# Altium schematic sheet 0037_PCH_PCIe_SATA.SchDoc
size A3
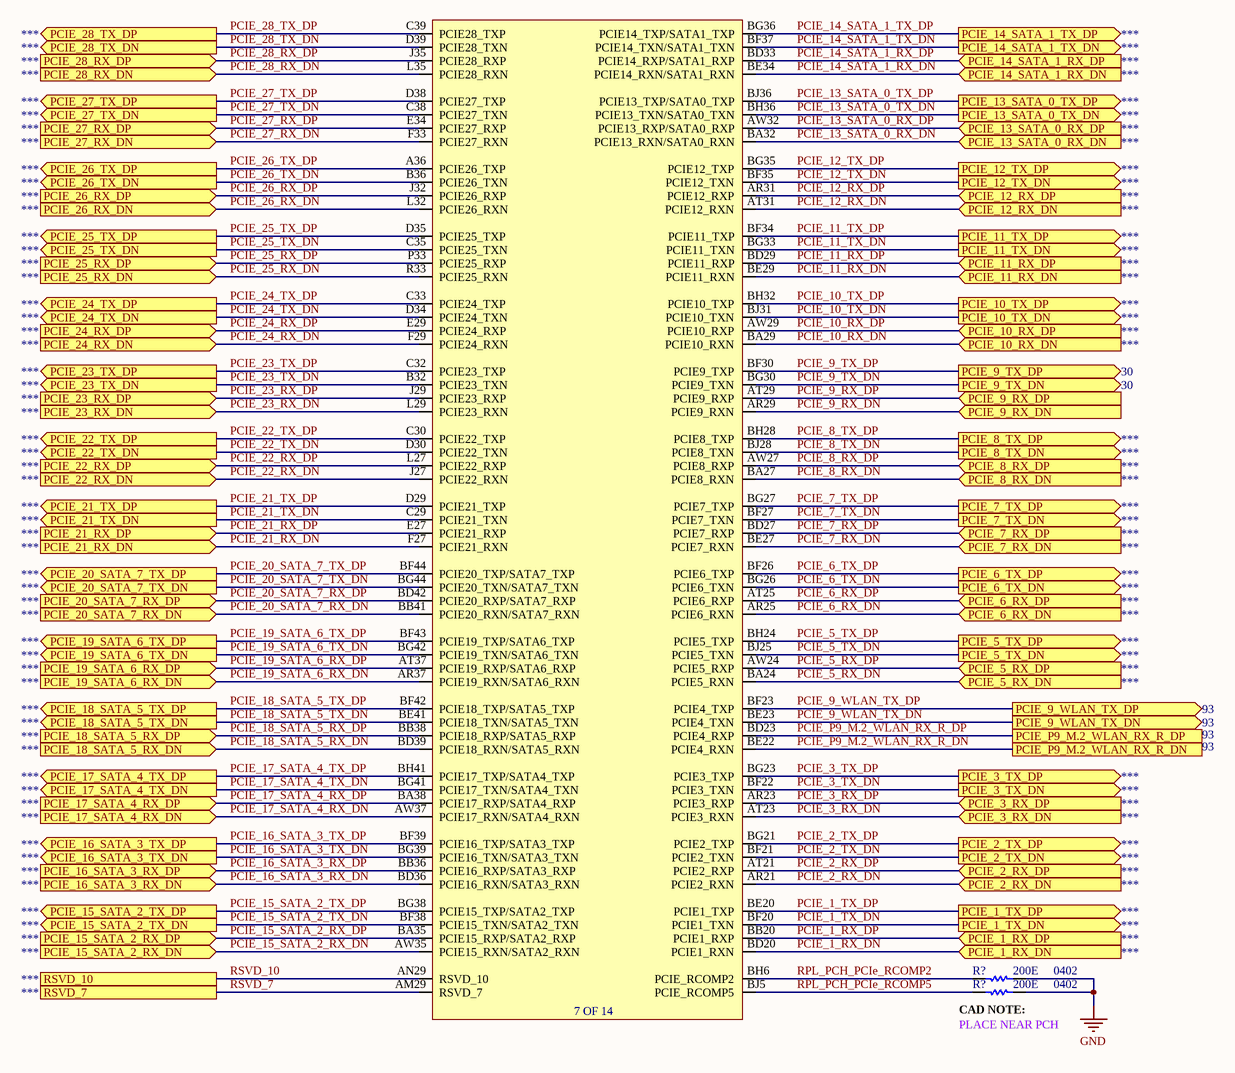
[diagram p0: 0037_PCH_PCIe_SATA.SchDoc]

## Parts
(Parts that share a designator on the sheet are numbered #1, #2 ... from top to bottom, then left to right.)
R?#1  value 200E  Case/Package: 0402  [RESC0402]  (hidden comment: Res)
R?#2  value 200E  Case/Package: 0402  [RESC0402]  (hidden comment: Res)
U23601  C_RPL_S_PCH_EXT  (value not drawn)  (part G of 14)

## Ports
PCIE_1_RX_DN (in), PCIE_1_RX_DP (in), PCIE_1_TX_DN (out), PCIE_1_TX_DP (out), PCIE_2_RX_DN (in), PCIE_2_RX_DP (in), PCIE_2_TX_DN (out), PCIE_2_TX_DP (out), PCIE_3_RX_DN (in), PCIE_3_RX_DP (in), PCIE_3_TX_DN (out), PCIE_3_TX_DP (out), PCIE_5_RX_DN (in), PCIE_5_RX_DP (in), PCIE_5_TX_DN (out), PCIE_5_TX_DP (out), PCIE_6_RX_DN (in), PCIE_6_RX_DP (in), PCIE_6_TX_DN (out), PCIE_6_TX_DP (out), PCIE_7_RX_DN (in), PCIE_7_RX_DP (in), PCIE_7_TX_DN (out), PCIE_7_TX_DP (out), PCIE_8_RX_DN (in), PCIE_8_RX_DP (in), PCIE_8_TX_DN (out), PCIE_8_TX_DP (out), PCIE_9_RX_DN (in), PCIE_9_RX_DP (in), PCIE_9_TX_DN (out), PCIE_9_TX_DP (out), PCIE_9_WLAN_TX_DN (out), PCIE_9_WLAN_TX_DP (out), PCIE_10_RX_DN (in), PCIE_10_RX_DP (in), PCIE_10_TX_DN (out), PCIE_10_TX_DP (out), PCIE_11_RX_DN (in), PCIE_11_RX_DP (in), PCIE_11_TX_DN (out), PCIE_11_TX_DP (out), PCIE_12_RX_DN (in), PCIE_12_RX_DP (in), PCIE_12_TX_DN (out), PCIE_12_TX_DP (out), PCIE_13_SATA_0_RX_DN (in), PCIE_13_SATA_0_RX_DP (in), PCIE_13_SATA_0_TX_DN (out), PCIE_13_SATA_0_TX_DP (out), PCIE_14_SATA_1_RX_DN (in), PCIE_14_SATA_1_RX_DP (in), PCIE_14_SATA_1_TX_DN (out), PCIE_14_SATA_1_TX_DP (out), PCIE_15_SATA_2_RX_DN (in), PCIE_15_SATA_2_RX_DP (in), PCIE_15_SATA_2_TX_DN (out), PCIE_15_SATA_2_TX_DP (out), PCIE_16_SATA_3_RX_DN (in), PCIE_16_SATA_3_RX_DP (in), PCIE_16_SATA_3_TX_DN (out), PCIE_16_SATA_3_TX_DP (out), PCIE_17_SATA_4_RX_DN (in), PCIE_17_SATA_4_RX_DP (in), PCIE_17_SATA_4_TX_DN (out), PCIE_17_SATA_4_TX_DP (out), PCIE_18_SATA_5_RX_DN (in), PCIE_18_SATA_5_RX_DP (in), PCIE_18_SATA_5_TX_DN (out), PCIE_18_SATA_5_TX_DP (out), PCIE_19_SATA_6_RX_DN (in), PCIE_19_SATA_6_RX_DP (in), PCIE_19_SATA_6_TX_DN (out), PCIE_19_SATA_6_TX_DP (out), PCIE_20_SATA_7_RX_DN (in), PCIE_20_SATA_7_RX_DP (in), PCIE_20_SATA_7_TX_DN (out), PCIE_20_SATA_7_TX_DP (out), PCIE_21_RX_DN (in), PCIE_21_RX_DP (in), PCIE_21_TX_DN (out), PCIE_21_TX_DP (out), PCIE_22_RX_DN (in), PCIE_22_RX_DP (in), PCIE_22_TX_DN (out), PCIE_22_TX_DP (out), PCIE_23_RX_DN (in), PCIE_23_RX_DP (in), PCIE_23_TX_DN (out), PCIE_23_TX_DP (out), PCIE_24_RX_DN (in), PCIE_24_RX_DP (in), PCIE_24_TX_DN (out), PCIE_24_TX_DP (out), PCIE_25_RX_DN (in), PCIE_25_RX_DP (in), PCIE_25_TX_DN (out), PCIE_25_TX_DP (out), PCIE_26_RX_DN (in), PCIE_26_RX_DP (in), PCIE_26_TX_DN (out), PCIE_26_TX_DP (out), PCIE_27_RX_DN (in), PCIE_27_RX_DP (in), PCIE_27_TX_DN (out), PCIE_27_TX_DP (out), PCIE_28_RX_DN (in), PCIE_28_RX_DP (in), PCIE_28_TX_DN (out), PCIE_28_TX_DP (out), PCIE_P9_M.2_WLAN_RX_R_DN, PCIE_P9_M.2_WLAN_RX_R_DP, RSVD_7, RSVD_10

## Nets
GND: R?#1.2 R?#2.2
PCIE_1_RX_DN: U23601.BD20(PCIE1_RXN) ; port PCIE_1_RX_DN
PCIE_1_RX_DP: U23601.BB20(PCIE1_RXP) ; port PCIE_1_RX_DP
PCIE_1_TX_DN: U23601.BF20(PCIE1_TXN) ; port PCIE_1_TX_DN
PCIE_1_TX_DP: U23601.BE20(PCIE1_TXP) ; port PCIE_1_TX_DP
PCIE_2_RX_DN: U23601.AR21(PCIE2_RXN) ; port PCIE_2_RX_DN
PCIE_2_RX_DP: U23601.AT21(PCIE2_RXP) ; port PCIE_2_RX_DP
PCIE_2_TX_DN: U23601.BF21(PCIE2_TXN) ; port PCIE_2_TX_DN
PCIE_2_TX_DP: U23601.BG21(PCIE2_TXP) ; port PCIE_2_TX_DP
PCIE_3_RX_DN: U23601.AT23(PCIE3_RXN) ; port PCIE_3_RX_DN
PCIE_3_RX_DP: U23601.AR23(PCIE3_RXP) ; port PCIE_3_RX_DP
PCIE_3_TX_DN: U23601.BF22(PCIE3_TXN) ; port PCIE_3_TX_DN
PCIE_3_TX_DP: U23601.BG23(PCIE3_TXP) ; port PCIE_3_TX_DP
PCIE_5_RX_DN: U23601.BA24(PCIE5_RXN) ; port PCIE_5_RX_DN
PCIE_5_RX_DP: U23601.AW24(PCIE5_RXP) ; port PCIE_5_RX_DP
PCIE_5_TX_DN: U23601.BJ25(PCIE5_TXN) ; port PCIE_5_TX_DN
PCIE_5_TX_DP: U23601.BH24(PCIE5_TXP) ; port PCIE_5_TX_DP
PCIE_6_RX_DN: U23601.AR25(PCIE6_RXN) ; port PCIE_6_RX_DN
PCIE_6_RX_DP: U23601.AT25(PCIE6_RXP) ; port PCIE_6_RX_DP
PCIE_6_TX_DN: U23601.BG26(PCIE6_TXN) ; port PCIE_6_TX_DN
PCIE_6_TX_DP: U23601.BF26(PCIE6_TXP) ; port PCIE_6_TX_DP
PCIE_7_RX_DN: U23601.BE27(PCIE7_RXN) ; port PCIE_7_RX_DN
PCIE_7_RX_DP: U23601.BD27(PCIE7_RXP) ; port PCIE_7_RX_DP
PCIE_7_TX_DN: U23601.BF27(PCIE7_TXN) ; port PCIE_7_TX_DN
PCIE_7_TX_DP: U23601.BG27(PCIE7_TXP) ; port PCIE_7_TX_DP
PCIE_8_RX_DN: U23601.BA27(PCIE8_RXN) ; port PCIE_8_RX_DN
PCIE_8_RX_DP: U23601.AW27(PCIE8_RXP) ; port PCIE_8_RX_DP
PCIE_8_TX_DN: U23601.BJ28(PCIE8_TXN) ; port PCIE_8_TX_DN
PCIE_8_TX_DP: U23601.BH28(PCIE8_TXP) ; port PCIE_8_TX_DP
PCIE_9_RX_DN: U23601.AR29(PCIE9_RXN) ; port PCIE_9_RX_DN
PCIE_9_RX_DP: U23601.AT29(PCIE9_RXP) ; port PCIE_9_RX_DP
PCIE_9_TX_DN: U23601.BG30(PCIE9_TXN) ; port PCIE_9_TX_DN
PCIE_9_TX_DP: U23601.BF30(PCIE9_TXP) ; port PCIE_9_TX_DP
PCIE_9_WLAN_TX_DN: U23601.BE23(PCIE4_TXN) ; port PCIE_9_WLAN_TX_DN
PCIE_9_WLAN_TX_DP: U23601.BF23(PCIE4_TXP) ; port PCIE_9_WLAN_TX_DP
PCIE_10_RX_DN: U23601.BA29(PCIE10_RXN) ; port PCIE_10_RX_DN
PCIE_10_RX_DP: U23601.AW29(PCIE10_RXP) ; port PCIE_10_RX_DP
PCIE_10_TX_DN: U23601.BJ31(PCIE10_TXN) ; port PCIE_10_TX_DN
PCIE_10_TX_DP: U23601.BH32(PCIE10_TXP) ; port PCIE_10_TX_DP
PCIE_11_RX_DN: U23601.BE29(PCIE11_RXN) ; port PCIE_11_RX_DN
PCIE_11_RX_DP: U23601.BD29(PCIE11_RXP) ; port PCIE_11_RX_DP
PCIE_11_TX_DN: U23601.BG33(PCIE11_TXN) ; port PCIE_11_TX_DN
PCIE_11_TX_DP: U23601.BF34(PCIE11_TXP) ; port PCIE_11_TX_DP
PCIE_12_RX_DN: U23601.AT31(PCIE12_RXN) ; port PCIE_12_RX_DN
PCIE_12_RX_DP: U23601.AR31(PCIE12_RXP) ; port PCIE_12_RX_DP
PCIE_12_TX_DN: U23601.BF35(PCIE12_TXN) ; port PCIE_12_TX_DN
PCIE_12_TX_DP: U23601.BG35(PCIE12_TXP) ; port PCIE_12_TX_DP
PCIE_13_SATA_0_RX_DN: U23601.BA32(PCIE13_RXN/SATA0_RXN) ; port PCIE_13_SATA_0_RX_DN
PCIE_13_SATA_0_RX_DP: U23601.AW32(PCIE13_RXP/SATA0_RXP) ; port PCIE_13_SATA_0_RX_DP
PCIE_13_SATA_0_TX_DN: U23601.BH36(PCIE13_TXN/SATA0_TXN) ; port PCIE_13_SATA_0_TX_DN
PCIE_13_SATA_0_TX_DP: U23601.BJ36(PCIE13_TXP/SATA0_TXP) ; port PCIE_13_SATA_0_TX_DP
PCIE_14_SATA_1_RX_DN: U23601.BE34(PCIE14_RXN/SATA1_RXN) ; port PCIE_14_SATA_1_RX_DN
PCIE_14_SATA_1_RX_DP: U23601.BD33(PCIE14_RXP/SATA1_RXP) ; port PCIE_14_SATA_1_RX_DP
PCIE_14_SATA_1_TX_DN: U23601.BF37(PCIE14_TXN/SATA1_TXN) ; port PCIE_14_SATA_1_TX_DN
PCIE_14_SATA_1_TX_DP: U23601.BG36(PCIE14_TXP/SATA1_TXP) ; port PCIE_14_SATA_1_TX_DP
PCIE_15_SATA_2_RX_DN: U23601.AW35(PCIE15_RXN/SATA2_RXN) ; port PCIE_15_SATA_2_RX_DN
PCIE_15_SATA_2_RX_DP: U23601.BA35(PCIE15_RXP/SATA2_RXP) ; port PCIE_15_SATA_2_RX_DP
PCIE_15_SATA_2_TX_DN: U23601.BF38(PCIE15_TXN/SATA2_TXN) ; port PCIE_15_SATA_2_TX_DN
PCIE_15_SATA_2_TX_DP: U23601.BG38(PCIE15_TXP/SATA2_TXP) ; port PCIE_15_SATA_2_TX_DP
PCIE_16_SATA_3_RX_DN: U23601.BD36(PCIE16_RXN/SATA3_RXN) ; port PCIE_16_SATA_3_RX_DN
PCIE_16_SATA_3_RX_DP: U23601.BB36(PCIE16_RXP/SATA3_RXP) ; port PCIE_16_SATA_3_RX_DP
PCIE_16_SATA_3_TX_DN: U23601.BG39(PCIE16_TXN/SATA3_TXN) ; port PCIE_16_SATA_3_TX_DN
PCIE_16_SATA_3_TX_DP: U23601.BF39(PCIE16_TXP/SATA3_TXP) ; port PCIE_16_SATA_3_TX_DP
PCIE_17_SATA_4_RX_DN: U23601.AW37(PCIE17_RXN/SATA4_RXN) ; port PCIE_17_SATA_4_RX_DN
PCIE_17_SATA_4_RX_DP: U23601.BA38(PCIE17_RXP/SATA4_RXP) ; port PCIE_17_SATA_4_RX_DP
PCIE_17_SATA_4_TX_DN: U23601.BG41(PCIE17_TXN/SATA4_TXN) ; port PCIE_17_SATA_4_TX_DN
PCIE_17_SATA_4_TX_DP: U23601.BH41(PCIE17_TXP/SATA4_TXP) ; port PCIE_17_SATA_4_TX_DP
PCIE_18_SATA_5_RX_DN: U23601.BD39(PCIE18_RXN/SATA5_RXN) ; port PCIE_18_SATA_5_RX_DN
PCIE_18_SATA_5_RX_DP: U23601.BB38(PCIE18_RXP/SATA5_RXP) ; port PCIE_18_SATA_5_RX_DP
PCIE_18_SATA_5_TX_DN: U23601.BE41(PCIE18_TXN/SATA5_TXN) ; port PCIE_18_SATA_5_TX_DN
PCIE_18_SATA_5_TX_DP: U23601.BF42(PCIE18_TXP/SATA5_TXP) ; port PCIE_18_SATA_5_TX_DP
PCIE_19_SATA_6_RX_DN: U23601.AR37(PCIE19_RXN/SATA6_RXN) ; port PCIE_19_SATA_6_RX_DN
PCIE_19_SATA_6_RX_DP: U23601.AT37(PCIE19_RXP/SATA6_RXP) ; port PCIE_19_SATA_6_RX_DP
PCIE_19_SATA_6_TX_DN: U23601.BG42(PCIE19_TXN/SATA6_TXN) ; port PCIE_19_SATA_6_TX_DN
PCIE_19_SATA_6_TX_DP: U23601.BF43(PCIE19_TXP/SATA6_TXP) ; port PCIE_19_SATA_6_TX_DP
PCIE_20_SATA_7_RX_DN: U23601.BB41(PCIE20_RXN/SATA7_RXN) ; port PCIE_20_SATA_7_RX_DN
PCIE_20_SATA_7_RX_DP: U23601.BD42(PCIE20_RXP/SATA7_RXP) ; port PCIE_20_SATA_7_RX_DP
PCIE_20_SATA_7_TX_DN: U23601.BG44(PCIE20_TXN/SATA7_TXN) ; port PCIE_20_SATA_7_TX_DN
PCIE_20_SATA_7_TX_DP: U23601.BF44(PCIE20_TXP/SATA7_TXP) ; port PCIE_20_SATA_7_TX_DP
PCIE_21_RX_DN: U23601.F27(PCIE21_RXN) ; port PCIE_21_RX_DN
PCIE_21_RX_DP: U23601.E27(PCIE21_RXP) ; port PCIE_21_RX_DP
PCIE_21_TX_DN: U23601.C29(PCIE21_TXN) ; port PCIE_21_TX_DN
PCIE_21_TX_DP: U23601.D29(PCIE21_TXP) ; port PCIE_21_TX_DP
PCIE_22_RX_DN: U23601.J27(PCIE22_RXN) ; port PCIE_22_RX_DN
PCIE_22_RX_DP: U23601.L27(PCIE22_RXP) ; port PCIE_22_RX_DP
PCIE_22_TX_DN: U23601.D30(PCIE22_TXN) ; port PCIE_22_TX_DN
PCIE_22_TX_DP: U23601.C30(PCIE22_TXP) ; port PCIE_22_TX_DP
PCIE_23_RX_DN: U23601.L29(PCIE23_RXN) ; port PCIE_23_RX_DN
PCIE_23_RX_DP: U23601.J29(PCIE23_RXP) ; port PCIE_23_RX_DP
PCIE_23_TX_DN: U23601.B32(PCIE23_TXN) ; port PCIE_23_TX_DN
PCIE_23_TX_DP: U23601.C32(PCIE23_TXP) ; port PCIE_23_TX_DP
PCIE_24_RX_DN: U23601.F29(PCIE24_RXN) ; port PCIE_24_RX_DN
PCIE_24_RX_DP: U23601.E29(PCIE24_RXP) ; port PCIE_24_RX_DP
PCIE_24_TX_DN: U23601.D34(PCIE24_TXN) ; port PCIE_24_TX_DN
PCIE_24_TX_DP: U23601.C33(PCIE24_TXP) ; port PCIE_24_TX_DP
PCIE_25_RX_DN: U23601.R33(PCIE25_RXN) ; port PCIE_25_RX_DN
PCIE_25_RX_DP: U23601.P33(PCIE25_RXP) ; port PCIE_25_RX_DP
PCIE_25_TX_DN: U23601.C35(PCIE25_TXN) ; port PCIE_25_TX_DN
PCIE_25_TX_DP: U23601.D35(PCIE25_TXP) ; port PCIE_25_TX_DP
PCIE_26_RX_DN: U23601.L32(PCIE26_RXN) ; port PCIE_26_RX_DN
PCIE_26_RX_DP: U23601.J32(PCIE26_RXP) ; port PCIE_26_RX_DP
PCIE_26_TX_DN: U23601.B36(PCIE26_TXN) ; port PCIE_26_TX_DN
PCIE_26_TX_DP: U23601.A36(PCIE26_TXP) ; port PCIE_26_TX_DP
PCIE_27_RX_DN: U23601.F33(PCIE27_RXN) ; port PCIE_27_RX_DN
PCIE_27_RX_DP: U23601.E34(PCIE27_RXP) ; port PCIE_27_RX_DP
PCIE_27_TX_DN: U23601.C38(PCIE27_TXN) ; port PCIE_27_TX_DN
PCIE_27_TX_DP: U23601.D38(PCIE27_TXP) ; port PCIE_27_TX_DP
PCIE_28_RX_DN: U23601.L35(PCIE28_RXN) ; port PCIE_28_RX_DN
PCIE_28_RX_DP: U23601.J35(PCIE28_RXP) ; port PCIE_28_RX_DP
PCIE_28_TX_DN: U23601.D39(PCIE28_TXN) ; port PCIE_28_TX_DN
PCIE_28_TX_DP: U23601.C39(PCIE28_TXP) ; port PCIE_28_TX_DP
PCIE_P9_M.2_WLAN_RX_R_DN: U23601.BE22(PCIE4_RXN) ; port PCIE_P9_M.2_WLAN_RX_R_DN
PCIE_P9_M.2_WLAN_RX_R_DP: U23601.BD23(PCIE4_RXP) ; port PCIE_P9_M.2_WLAN_RX_R_DP
RPL_PCH_PCIe_RCOMP2: R?#1.1 U23601.BH6(PCIE_RCOMP2)
RPL_PCH_PCIe_RCOMP5: R?#2.1 U23601.BJ5(PCIE_RCOMP5)
RSVD_7: U23601.AM29(RSVD_7) ; port RSVD_7
RSVD_10: U23601.AN29(RSVD_10) ; port RSVD_10

## Notes on the sheet
- (near R?#2) CAD NOTE:
- (near R?#2) PLACE NEAR PCH
- (in symbol C_RPL_S_PCH_EXT, part G) 7 OF 14

## Library data of the parts
R?#1 R?#2 = Res: Thick Film Resistor -  200ohm, 1%, 0402
U23601 = C_RPL_S_PCH_EXT: Manufacturer Part Number: *; Case/Package: *